# Altium schematic sheet Main.SchDoc
size A
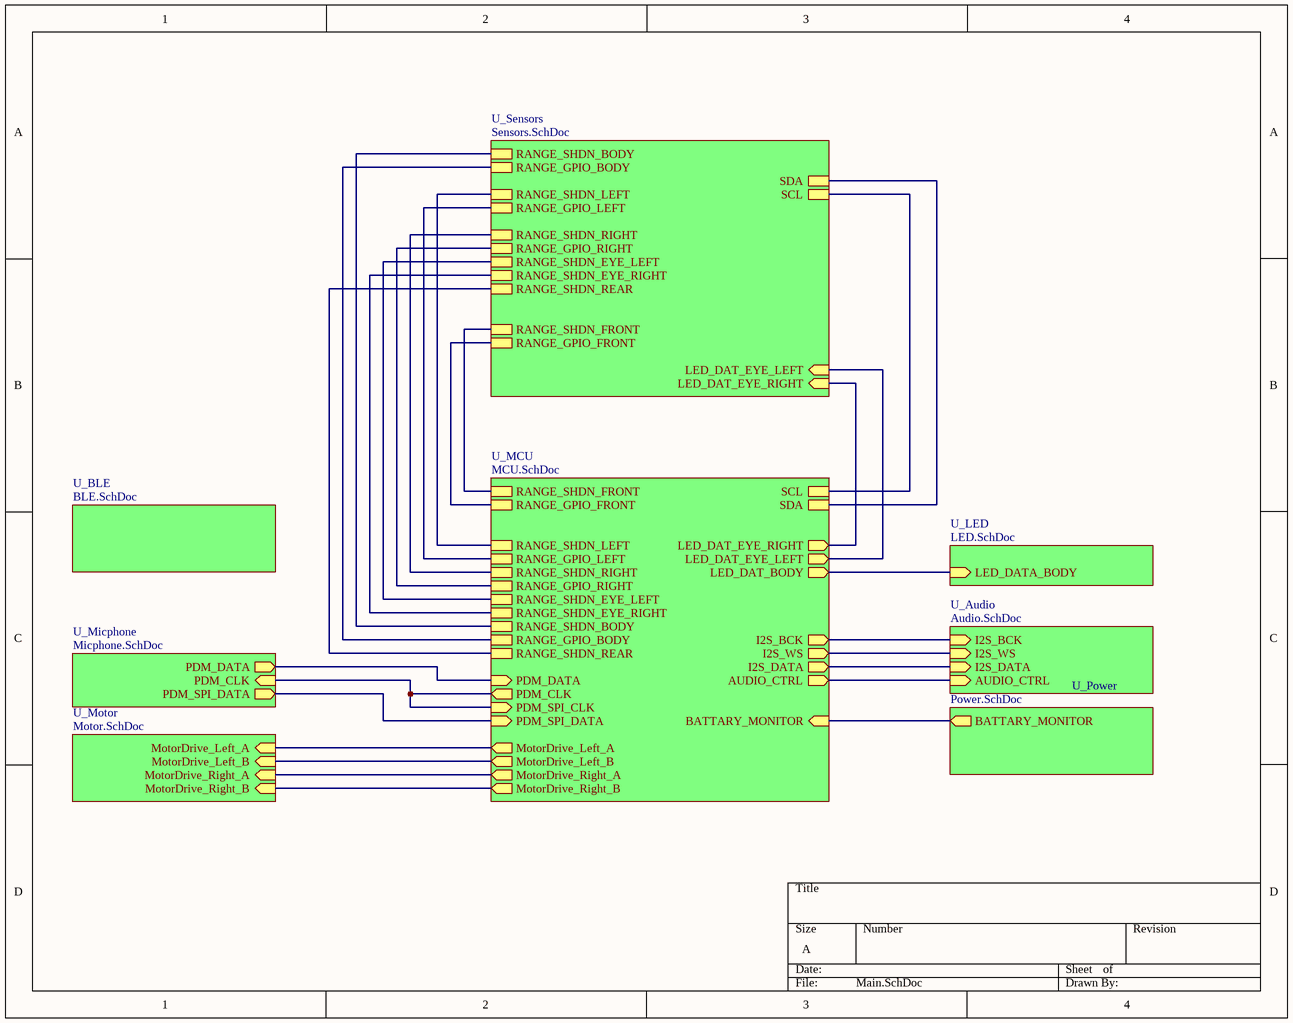
[diagram p0: Main.SchDoc]

## Sub-sheets
U_Audio = Audio.SchDoc: I2S_BCK (in), I2S_WS (in), I2S_DATA (in), AUDIO_CTRL (in)
U_BLE = BLE.SchDoc: no entries
U_LED = LED.SchDoc: LED_DATA_BODY (in)
U_MCU = MCU.SchDoc: RANGE_SHDN_FRONT, RANGE_GPIO_FRONT, SDA, SCL, LED_DAT_BODY (out), LED_DAT_EYE_RIGHT (out), LED_DAT_EYE_LEFT (out), RANGE_SHDN_LEFT, RANGE_GPIO_LEFT, RANGE_SHDN_RIGHT, RANGE_GPIO_RIGHT, RANGE_SHDN_EYE_LEFT, RANGE_SHDN_EYE_RIGHT, RANGE_SHDN_BODY, RANGE_GPIO_BODY, RANGE_SHDN_REAR, PDM_DATA (in), PDM_CLK (out), PDM_SPI_DATA (in), MotorDrive_Left_A (out), MotorDrive_Left_B (out), MotorDrive_Right_A (out), MotorDrive_Right_B (out), BATTARY_MONITOR (in), I2S_BCK (out), I2S_WS (out), I2S_DATA (out), PDM_SPI_CLK (in), AUDIO_CTRL (out)
U_Micphone = Micphone.SchDoc: PDM_DATA (out), PDM_CLK (in), PDM_SPI_DATA (out)
U_Motor = Motor.SchDoc: MotorDrive_Left_A (in), MotorDrive_Left_B (in), MotorDrive_Right_A (in), MotorDrive_Right_B (in)
U_Power = Power.SchDoc: BATTARY_MONITOR (out)
U_Sensors = Sensors.SchDoc: RANGE_SHDN_BODY, RANGE_GPIO_BODY, SDA, SCL, RANGE_SHDN_LEFT, RANGE_GPIO_LEFT, RANGE_SHDN_RIGHT, RANGE_GPIO_RIGHT, RANGE_SHDN_EYE_LEFT, RANGE_SHDN_EYE_RIGHT, RANGE_SHDN_REAR, RANGE_SHDN_FRONT, RANGE_GPIO_FRONT, LED_DAT_EYE_RIGHT (in), LED_DAT_EYE_LEFT (in)

## Nets
(unnamed): sheet U_Audio/I2S_BCK, sheet U_MCU/I2S_BCK
(unnamed): sheet U_Audio/I2S_WS, sheet U_MCU/I2S_WS
(unnamed): sheet U_Audio/I2S_DATA, sheet U_MCU/I2S_DATA
(unnamed): sheet U_Audio/AUDIO_CTRL, sheet U_MCU/AUDIO_CTRL
(unnamed): sheet U_LED/LED_DATA_BODY, sheet U_MCU/LED_DAT_BODY
(unnamed): sheet U_MCU/RANGE_SHDN_FRONT, sheet U_Sensors/RANGE_SHDN_FRONT
(unnamed): sheet U_MCU/RANGE_GPIO_FRONT, sheet U_Sensors/RANGE_GPIO_FRONT
(unnamed): sheet U_MCU/SDA, sheet U_Sensors/SDA
(unnamed): sheet U_MCU/SCL, sheet U_Sensors/SCL
(unnamed): sheet U_MCU/LED_DAT_EYE_RIGHT, sheet U_Sensors/LED_DAT_EYE_RIGHT
(unnamed): sheet U_MCU/LED_DAT_EYE_LEFT, sheet U_Sensors/LED_DAT_EYE_LEFT
(unnamed): sheet U_MCU/RANGE_SHDN_LEFT, sheet U_Sensors/RANGE_SHDN_LEFT
(unnamed): sheet U_MCU/RANGE_GPIO_LEFT, sheet U_Sensors/RANGE_GPIO_LEFT
(unnamed): sheet U_MCU/RANGE_SHDN_RIGHT, sheet U_Sensors/RANGE_SHDN_RIGHT
(unnamed): sheet U_MCU/RANGE_GPIO_RIGHT, sheet U_Sensors/RANGE_GPIO_RIGHT
(unnamed): sheet U_MCU/RANGE_SHDN_EYE_LEFT, sheet U_Sensors/RANGE_SHDN_EYE_LEFT
(unnamed): sheet U_MCU/RANGE_SHDN_EYE_RIGHT, sheet U_Sensors/RANGE_SHDN_EYE_RIGHT
(unnamed): sheet U_MCU/RANGE_SHDN_BODY, sheet U_Sensors/RANGE_SHDN_BODY
(unnamed): sheet U_MCU/RANGE_GPIO_BODY, sheet U_Sensors/RANGE_GPIO_BODY
(unnamed): sheet U_MCU/RANGE_SHDN_REAR, sheet U_Sensors/RANGE_SHDN_REAR
(unnamed): sheet U_MCU/PDM_DATA, sheet U_Micphone/PDM_DATA
(unnamed): sheet U_MCU/PDM_CLK, sheet U_MCU/PDM_SPI_CLK, sheet U_Micphone/PDM_CLK
(unnamed): sheet U_MCU/PDM_SPI_DATA, sheet U_Micphone/PDM_SPI_DATA
(unnamed): sheet U_MCU/MotorDrive_Left_A, sheet U_Motor/MotorDrive_Left_A
(unnamed): sheet U_MCU/MotorDrive_Left_B, sheet U_Motor/MotorDrive_Left_B
(unnamed): sheet U_MCU/MotorDrive_Right_A, sheet U_Motor/MotorDrive_Right_A
(unnamed): sheet U_MCU/MotorDrive_Right_B, sheet U_Motor/MotorDrive_Right_B
(unnamed): sheet U_MCU/BATTARY_MONITOR, sheet U_Power/BATTARY_MONITOR